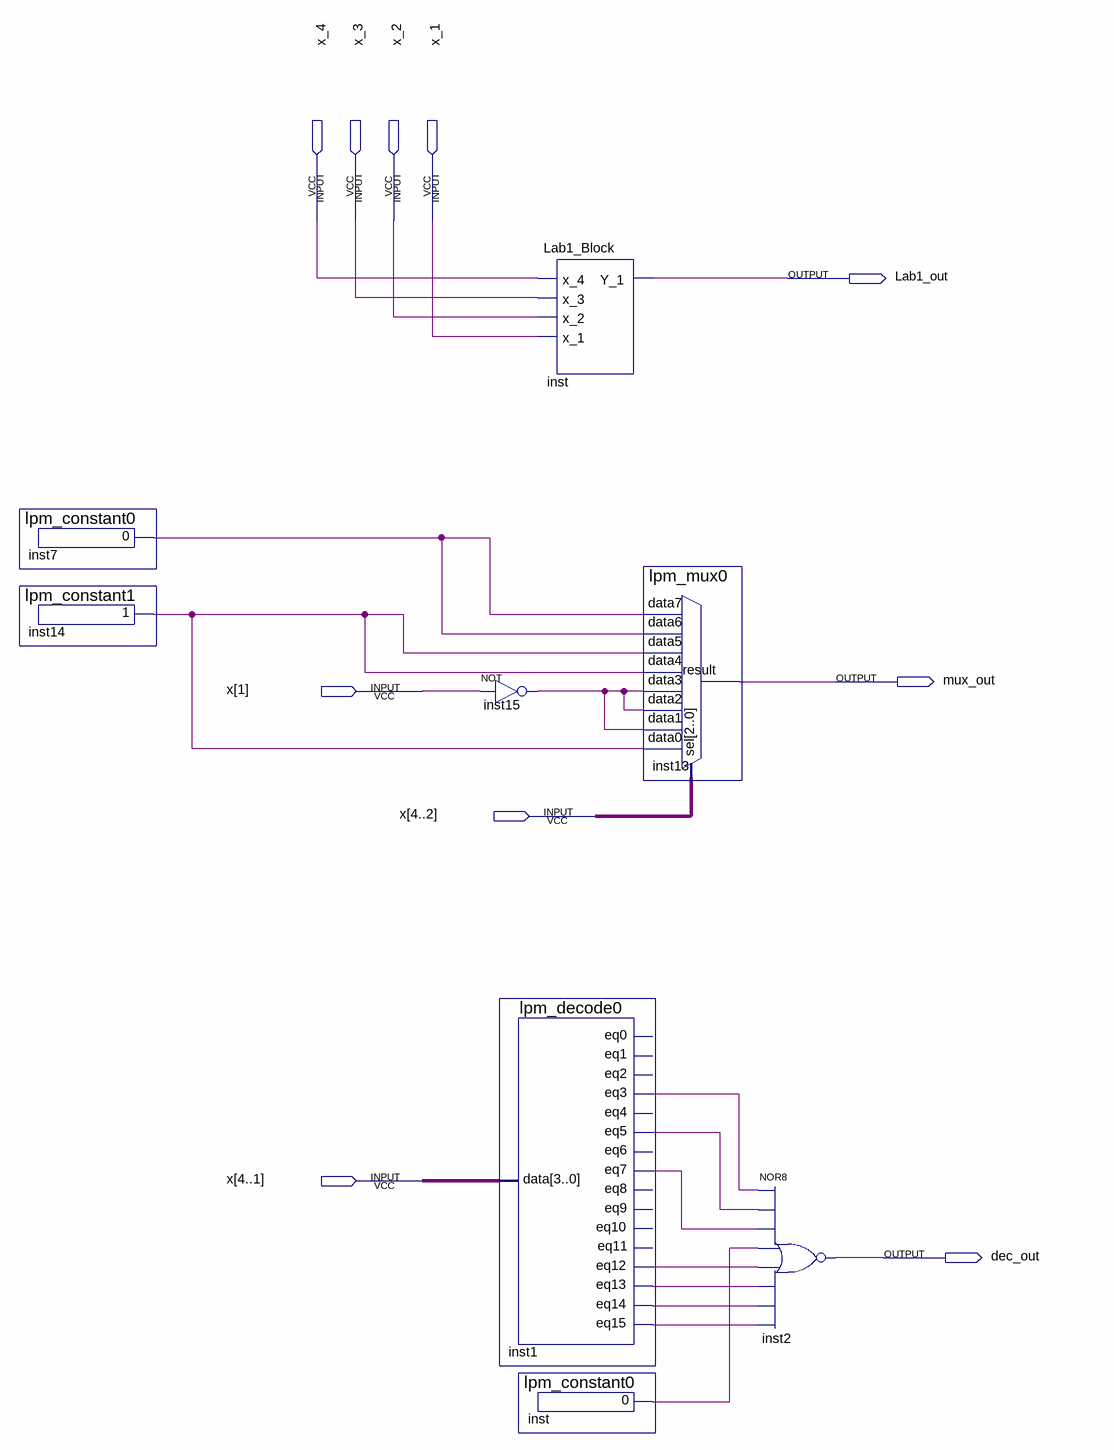
[diagram p0: schematic sheet]
// Quartus schematic MainBlock.bdf as structural Verilog: 8 symbols, 10 pins
module MainBlock (
  input  x_4,
  input  x_3,
  input  x_2,
  input  x_1,
  input  [4:1] x,
  output Lab1_out,
  output mux_out,
  output dec_out
);

  wire inst1_eq3, inst1_eq5, inst1_eq7, inst1_eq12, inst1_eq13, inst1_eq14, inst1_eq15, inst7_result,
       inst14_result, inst15_out, inst_result;

  lpm_constant0 inst7 (.result(inst7_result));
  lpm_constant1 inst14 (.result(inst14_result));
  Lab1_Block inst (.x_4(x_4), .x_3(x_3), .x_2(x_2), .x_1(x_1), .Y_1(Lab1_out));
  not inst15 (inst15_out, x[1]);
  lpm_decode0 inst1 (
    .data(x), .eq3(inst1_eq3), .eq5(inst1_eq5), .eq7(inst1_eq7), .eq12(inst1_eq12), .eq13(inst1_eq13),
    .eq14(inst1_eq14), .eq15(inst1_eq15));  // open: eq0, eq1, eq2, eq4, eq6, eq8, eq9, eq10, eq11
  lpm_constant0 inst_dup2 (.result(inst_result));
  lpm_mux0 inst13 (
    .data7(inst7_result), .data6(inst7_result), .data5(inst14_result), .data4(inst14_result),
    .data3(inst15_out), .data2(inst15_out), .data1(inst15_out), .data0(inst14_result), .sel(x[4:2]),
    .result(mux_out));
  nor inst2 (dec_out, inst1_eq3, inst1_eq5, inst1_eq7, inst_result, inst1_eq12, inst1_eq13, inst1_eq14, inst1_eq15);
endmodule
